# Altium schematic sheet Power.SchDoc
size 420 x 297 mm; SheetNumber: 4; SheetTotal: 14; PageSetup: Record=PageOptions|CenterHorizontal=True|CenterVertical=True|PrintScale=0.96|XCorrection=1.00|YCorrection=1.00|PrintKind=1|BorderSize=5000000|LeftOffset=0|BottomOffset=0|Orientation=2|PaperLength=4318|PaperWidth=2794|Scale=100|PaperSource=7|PrintQuality=600|MediaType=1|DitherType=10|PaperKind=11" x 17"|PrintScaleMode=1
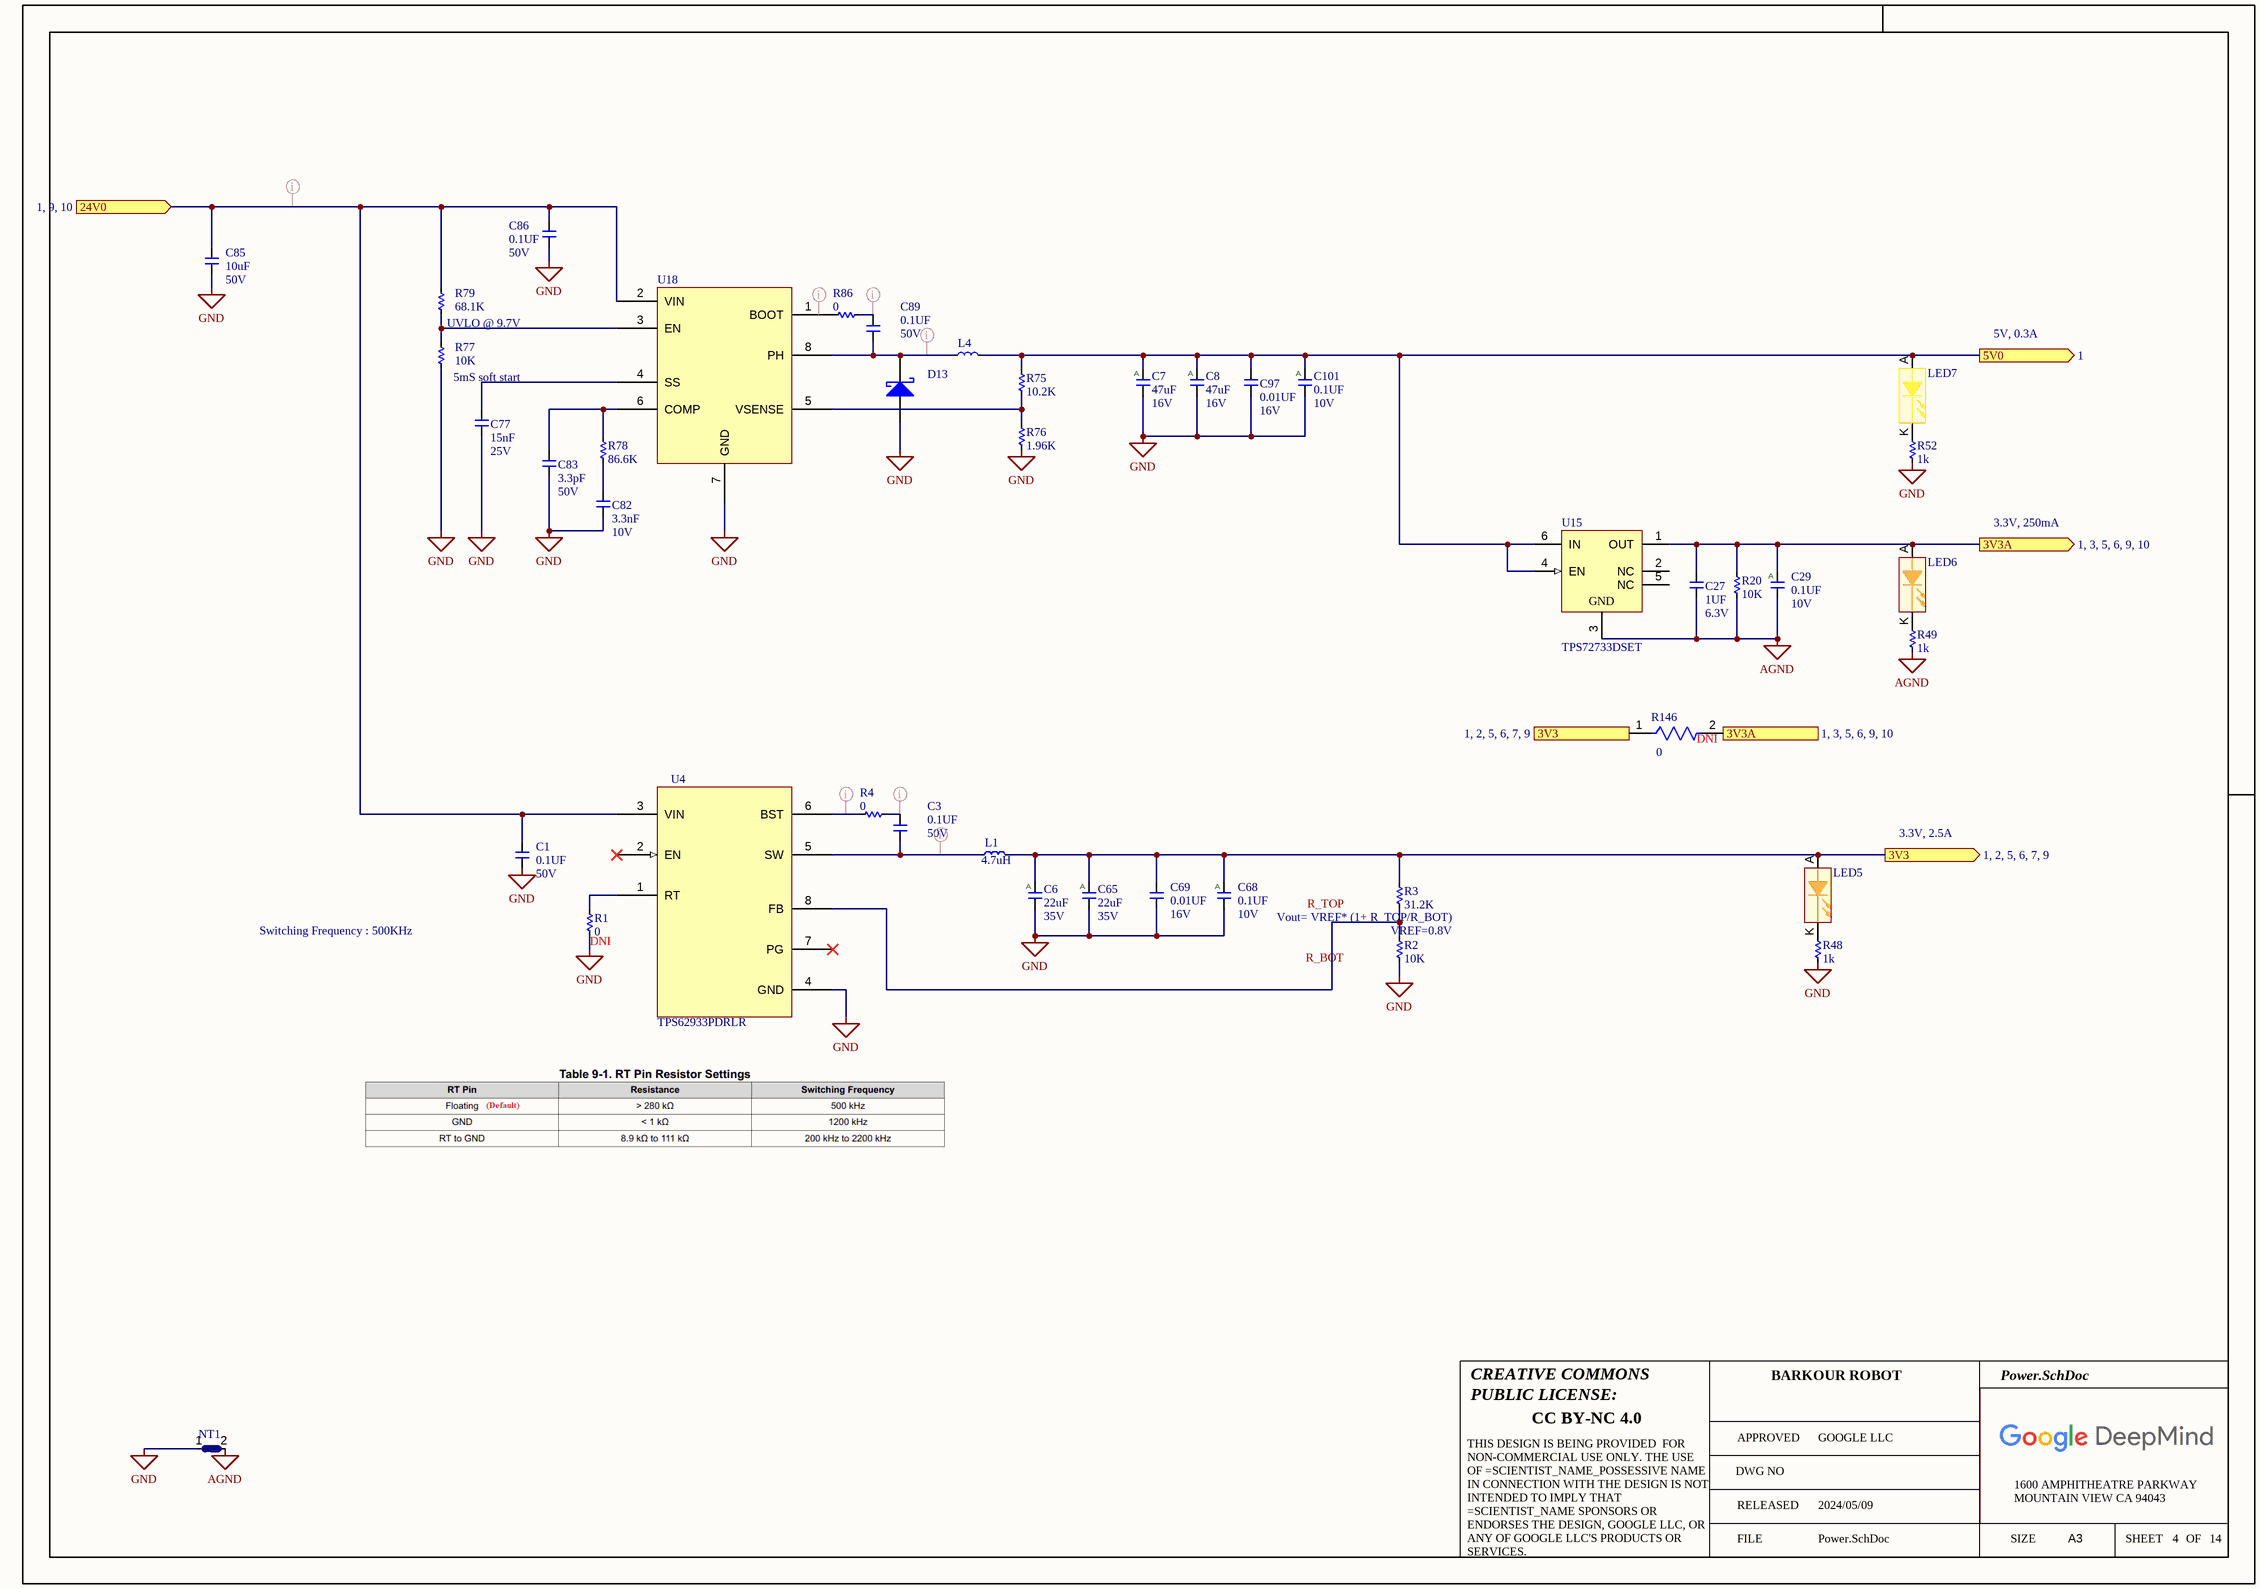
[diagram p0: Power.SchDoc]

## Parts
C1  value 0.1UF  Voltage: 50V  [C0402]  (hidden comment: __Template_Cap)
C3  value 0.1UF  Voltage: 50V  [C0402]  (hidden comment: __Template_Cap)
C6  Voltage: 35V  [C1206]  (hidden comment: 22uF)
C7  value 47uF  Voltage: 16V  [C2220]  (hidden comment: __Template_Cap_Auto)
C8  value 47uF  Voltage: 16V  [C2220]  (hidden comment: __Template_Cap_Auto)
C27  value 1UF  Voltage: 6.3V  [C0201]  (hidden comment: __Template_Cap)
C29  value 0.1UF  Voltage: 10V  [C0201]  (hidden comment: __Template_Cap_Auto)
C65  Voltage: 35V  [C1206]  (hidden comment: 22uF)
C68  value 0.1UF  Voltage: 10V  [C0201]  (hidden comment: __Template_Cap_Auto)
C69  value 0.01UF  Voltage: 16V  [C0201]  (hidden comment: __Template_Cap)
C77  value 15nF  Voltage: 25V  [C0402]  (hidden comment: __Template_Cap)
C82  value 3.3nF  Voltage: 10V  [C0201]  (hidden comment: __Template_Cap)
C83  value 3.3pF  Voltage: 50V  [C0201]  (hidden comment: __Template_Cap)
C85  value 10uF  Voltage: 50V  [C1210]  (hidden comment: __Template_Cap)
C86  value 0.1UF  Voltage: 50V  [C0402]  (hidden comment: __Template_Cap)
C89  value 0.1UF  Voltage: 50V  [C0402]  (hidden comment: __Template_Cap)
C97  value 0.01UF  Voltage: 16V  [C0201]  (hidden comment: __Template_Cap)
C101  value 0.1UF  Voltage: 10V  [C0201]  (hidden comment: __Template_Cap_Auto)
D13  __Template_DIODE_SCHOTTKY  [SOD-123_H1.35MM]  (value not drawn)
L1  4.7uH  [IND_78438357047]
L4  COILCRAFT_LPS3015-473  [COILCRAFT_LPS3015-473]  (value not drawn)
LED5  __Template_LED_ORANGE_AK  [LED_APG0603SYC-TT]  (value not drawn)
LED6  __Template_LED_ORANGE_AK  [LED_APG0603SYC-TT]  (value not drawn)
LED7  __Template_LED_YELLOW_AK  [LED_APG0603SYC-TT]  (value not drawn)
NT1  _Template_NETTIE  [NETTIE_0402]  (value not drawn)  (net tie, no BOM)
R1  0  [R0402]
R2  10K  [R0402]
R3  31.2K  [R0402]
R4  0  [R0402]
R20  value 10K  [R0201]  (hidden comment: __Template_Resistor)
R48  value 1k  [R0201]  (hidden comment: __Template_Resistor)
R49  value 1k  [R0201]  (hidden comment: __Template_Resistor)
R52  value 1k  [R0201]  (hidden comment: __Template_Resistor)
R75  10.2K  [R0201]
R76  1.96K  [R0201]
R77  value 10K  [R0201]  (hidden comment: __Template_Resistor)
R78  86.6K  [R0201]
R79  68.1K  [R0402]
R86  0  [R0402]
R146  0  [R0402]
U4  TPS62933PDRLR  [SOT-583]
U15  TPS72733DSET  [6WSON]
U18  TI_TPS54331GDR  [SOIC127P600X175-8N]  (value not drawn)

## Ports
3V3 (out, see 1, 2, 5, 6, 7, 9), 3V3A (out, see 1, 3, 5, 6, 9, 10), 5V0 (out, see 1), 24V0 (in, see 1, 9, 10)

## Nets
AGND: C27.2 C29.2 NT1.2 R20.1 R49.2 U15.3(GND)
GND: C1.2 C6.2 C7.2 C8.2 C65.2 C68.2 C69.2 C77.2 C82.2 C83.2 C85.2 C86.2 C97.2 C101.2 D13.A NT1.1 R1.1 R2.1 R48.2 R52.2 R76.1 R77.1 U4.4(GND) U18.7(GND)
3V3: C6.1 C65.1 C68.1 C69.1 L1.2 LED5.A R3.2 R146.1 ; port 3V3
3V3A: C27.1 C29.1 LED6.A R20.2 R146.2 U15.1(OUT) ; port 3V3A
5V0: C7.1 C8.1 C97.1 C101.1 L4.2 LED7.A R75.2 U15.4(EN) U15.6(IN) ; port 5V0
24V0: C1.1 C85.1 C86.1 R79.2 U4.3(VIN) U18.2(VIN) ; port 24V0
NetC3_1: C3.1 R4.2
NetC3_2: C3.2 L1.1 U4.5(SW)
NetC77_1: C77.1 U18.4(SS)
NetC82_1: C82.1 R78.1
NetC83_1: C83.1 R78.2 U18.6(COMP)
NetC89_1: C89.1 R86.2
NetC89_2: C89.2 D13.K L4.1 U18.8(PH)
NetLED5_K: LED5.K R48.1
NetLED6_K: LED6.K R49.1
NetLED7_K: LED7.K R52.1
NetR1_2: R1.2 U4.1(RT)
NetR2_2: R2.2 R3.1 U4.8(FB)
NetR4_1: R4.1 U4.6(BST)
NetR75_1: R75.1 R76.2 U18.5(VSENSE)
NetR77_2: R77.2 R79.1 U18.3(EN)
NetR86_1: R86.1 U18.1(BOOT)

Not connected (* = marked no-connect by the designer): U4 2(EN)* 7(PG)*; U15 2(NC) 5(NC)

## Layout directives
net class 24V: 24V0, (no net found under the mark), NetC3_1, NetC3_2, NetC89_1, NetC89_2, NetR4_1

## Notes on the sheet
- UVLO @ 9.7V
- 5mS soft start
- 5V, 0.3A
- 3.3V, 250mA
- 3.3V, 2.5A
- (near R1) Switching Frequency : 500KHz
- (near R3) R_TOP
- Vout= VREF* (1+ R_TOP/R_BOT)
- VREF=0.8V
- (near R2) R_BOT
- CREATIVE COMMONS
- PUBLIC LICENSE:
- BARKOUR ROBOT
- CC BY-NC 4.0
- APPROVED
- DWG NO
- GOOGLE LLC
- FILE
- RELEASED
- 2024/05/09
- SIZE
- 1600 AMPHITHEATRE PARKWAY
- MOUNTAIN VIEW CA 94043
- A3
- SHEET
- OF
- THIS DESIGN IS BEING PROVIDED  FOR NON-COMMERCIAL USE ONLY. THE USE OF =SCIENTIST_NAME_POSSESSIVE NAME IN CONNECTION WITH THE DESIGN IS NOT INTENDED TO IMPLY THAT =SCIENTIST_NAME SPONSORS OR ENDORSES THE DESIGN, GOOGLE LLC, OR ANY OF GOOGLE LLC'S PRODUCTS OR SERVICES.
- (in symbol 163) A
- (in symbol 934) A

## Library data of the parts
C1 C3 C86 C89 = 1762: CAP, CER, X5R, 0.1uF, 10%, 50V, 0402, 0.55mm; MFG: YAGEO; MFG P/N: CC0402KRX5R9BB104; Status: Released; Package: 0402; Supplier 1: Digi-Key; ComponentLink1URL: http://www.yageo.com/documents/recent/UPY-GPHC_X5R_4V-to-50V_25.pdf; Supplier Part Number 1: 311-3342-1-ND
C6 C65 = 163: CAP CER 22UF 35V X5R 1206; MFG: TDK Corporation; MFG P/N: C3216X5R1V226M160AC; Status: Released; Package: 1206; Value: 22uF; Supplier 1: Digi-Key; ComponentLink1URL: https://www.digikey.com/en/products/detail/tdk-corporation/C3216X5R1V226M160AC/2792261?s=N4IgTCBcDaIMIGYwEYBsANArAJWQNTDFQFk0AGAQThAF0BfIA; Supplier Part Number 1: 445-8045-1-ND
C7 C8 = 163: CAP, CER, X7R, 47uF, 16V, 20%, AUTO GRADE, 2220, 2.5mm T; MFG: TDK; MFG P/N: CGA9N3X7R1C476M230KB; COMMON: 150-00499-00; Status: Released; Package: 2220; Supplier 1: Digi-Key; ComponentLink1URL: https://www.digikey.com/en/products/detail/tdk-corporation/CGA9N3X7R1C476M230KB/2781361; Supplier Part Number 1: 445-7935-1-ND
C27 = 240: CAP, CER, X5R, 1uF, 6.3V, 20%, 0201, 0.33mm T; MFG: SAMSUNG; MFG P/N: CL03A105MQ3CSNC; COMMON: 150-00980-00; Status: Released; Package: 0201; Supplier 1: Digi-Key; ComponentLink1URL: https://www.digikey.com/en/products/detail/samsung-electro-mechanics/CL03A105MQ3CSNC/3886983; Supplier Part Number 1: 1276-1325-1-ND
C29 C68 C101 = 934: CAP, CER, X6S, 0.1uF, 10V, 10%, 0201, AUTOGRADE; MFG: MURATA; MFG P/N: GRT033C81A104KE01D; COMMON: 150-01178-00; Status: Released; Package: 0201; Supplier 1: Digi-key; ComponentLink1URL: https://search.murata.co.jp/Ceramy/image/img/A01X/G101/ENG/GRT033C81A104KE01-01.pdf; Supplier Part Number 1: 490-12232-1-ND
C69 C97 = 361: CAP, CER, X5R, 0.01uF, 16V, 10%, 0201, 0.33mm T; MFG: MURATA; MFG P/N: GRM033R61C103KA12D; COMMON: 150-00126-00; Status: Released; Package: 0201; Supplier 1: Digi-Key; ComponentLink1URL: https://www.digikey.com/en/products/detail/murata-electronics/GRM033R61C103KA12D/4213197; Supplier Part Number 1: 490-7223-1-ND
C77 = 838: CAP, CER, X7R, 0.015uF, 25V, 10%, 0402, 0.56mm T; MFG: MURATA; MFG P/N: GRM155R71E153KA61D; COMMON: 150-00741-00; Status: NRND; Package: 0402; Supplier 1: Digi-Key; ComponentLink1URL: https://www.digikey.com/en/products/detail/murata-electronics/GRM155R71E153KA61D/702516; Supplier Part Number 1: 490-3251-1-ND
C82 = 343: CAP, CER, X5R, 3300pF, 10V, 10%, 0201, 0.33mm T; MFG: AVX; MFG P/N: 0201ZD332KAT2A; COMMON: 150-00555-00; Status: Released; Package: 0201; Supplier 1: Digi-Key; ComponentLink1URL: https://www.digikey.com/en/products/detail/kyocera-avx/0201ZD332KAT2A/563155; Supplier Part Number 1: 478-1045-1-ND
C83 = 589: CAP, CER, NP0, 3.3pF, 50V, +/-0.25pF, 0201, 0.33mm T; MFG: MURATA; MFG P/N: GRM0335C1H3R3CA01D; COMMON: 150-00958-00; Status: Released; Package: 0201; Supplier 1: Digi-Key; ComponentLink1URL: https://www.digikey.com/en/products/detail/murata-electronics/GRM0335C1H3R3CA01D/2542225; Supplier Part Number 1: 490-6128-1-ND
C85 = 1813: CAP, CER, X5R, 10uF, 50V, 20%, 1210; MFG: TAIYO YUDEN; MFG P/N: UMK325BJ106MM-T; Status: Released; Package: 1210; Supplier 1: Digi-Key; ComponentLink1URL: https://media.digikey.com/pdf/Data%20Sheets/Taiyo%20Yuden%20PDFs%20URL%20links/UMK325BJ106MM-T_Spec.pdf; Supplier Part Number 1: 587-2225-1-ND
D13 = 290: DIODE, SCHOTTKY, 30V VRRM, 1A IO, 12A SURGE, SOD-123; MFG: Diodes Incorporated; MFG P/N: B130LAW-7-F; Value: B130LAW-7-F; Status: Released; Package: SOD-123; Supplier 1: Digi-Key; ComponentLink1URL: https://www.diodes.com/assets/Datasheets/ds30308.pdf; Supplier Part Number 1: B130LAW-FDICT-ND
L1 = BOURNS_SRR1050A-180Y: FIXED IND 4.7UH 3.9A 44MOHM SMD; MFG: Würth Elektronik; MFG P/N: 78438357047; Supplier 1: Digi-Key; Supplier Part Number 1: 732-11742-1-ND; ComponentLink1URL: https://www.bourns.com/docs/Product-Datasheets/SRR1050A.pdf?src-supplier=Digi-Key; Value: 4.7uH
L4 = COILCRAFT_LPS3015-473: COILCRAFT   LPS3015-473MRB   INDUCTOR, SHLD, 47UH, 20%, 0.3A, SMD; MFG P/N: XFL3012-473MEC; Supplier 1: Mouser; Supplier Part Number 1: 994-XFL3012-473MEC; ComponentLink1URL: https://www.mouser.com/ProductDetail/Coilcraft/XFL3012-473MEC?qs=zCSbvcPd3pb%2FTL0aawZbwA%3D%3D; MFG: Coilcraft; Value: 47uH
LED5 LED6 = 308: LED, ORANGE, 611NM, 10mA, CLEAR, 0201; MFG: Kingbright; MFG P/N: APG0603SEC-TT; Value: APG0603SEC-TT; Status: Released; Package: 0201; Supplier 1: Digi-Key; ComponentLink1URL: http://www.kingbrightusa.com/images/catalog/SPEC/APG0603SEC-TT.pdf; Supplier Part Number 1: 754-2027-1-ND
LED7 = 307: LED, YELLOW, 591NM, 10mA, CLEAR, 0201; MFG: Kingbright; MFG P/N: APG0603SYC-TT; Value: APG0603SYC-TT; Status: Released; Package: 0201; Supplier 1: Digi-Key; ComponentLink1URL: http://www.kingbrightusa.com/images/catalog/SPEC/APG0603SYC-TT.pdf; Supplier Part Number 1: 754-2025-1-ND
NT1 = 158: Net Ties, 0402; MFG: _PCB Feature; Status: Released
R1 R4 R86 = 8004: RES, 0, JUMPER, 1/16W, 0402; MFG: YAGEO; MFG P/N: RC0402FR-070RL; COMMON: 470-02332-00; Status: Released; Package: 0402; Value: 0; Supplier 1: Digi-Key; ComponentLink1URL: https://www.digikey.com/en/products/detail/yageo/RC0402FR-070RL/2827570; Supplier Part Number 1: 311-0.0LRCT-ND
  R1: DNI: DNI
R2 = 7216: RES, 10K, 1%, 1/10W, 0402, AUTOGRADE; MFG: PANASONIC; MFG P/N: ERJ2RKF1002X; COMMON: 470-00319-00; Status: Released; Package: 0402; Value: 10K; Supplier 1: Digi-Key; ComponentLink1URL: https://www.digikey.com/en/products/detail/panasonic-electronic-components/ERJ-2RKF1002X/192073; Supplier Part Number 1: P10.0KLCT-ND
R3 = 4161: RES 31.2K OHM 1% 1/16W 0402; MFG: KOA Speer Electronics, Inc.; MFG P/N: RN73H1ETTP3122F25; Status: Released; Package: 0402; Value: 31.2K; Supplier 1: Digi-Key; ComponentLink1URL: https://www.digikey.com/en/products/detail/yageo/RC0201FR-0710K2L/1948867; Supplier Part Number 1: 2019-RN73H1ETTP3122F25CT-ND
R20 R77 = 6783: RES, 10K, 1%, 1/20W, 0201, AUTOGRADE; MFG: PANASONIC; MFG P/N: ERJ1GNF1002C; COMMON: 470-00033-00; Status: Released; Package: 0201; Supplier 1: Digi-Key; ComponentLink1URL: https://industrial.panasonic.com/cdbs/www-data/pdf/RDA0000/AOA0000C304.pdf; Supplier Part Number 1: P122414CT-ND
R48 R49 R52 = 10010: RES, 1K, 1%, 1/20W, 0201, AUTOGRADE; MFG: Bourns Inc.; MFG P/N: CR0201AFW-1001GLF; Status: Released; Package: 0201; Supplier 1: Digi-Key; ComponentLink1URL: https://www.bourns.com/docs/product-datasheets/crxxxxa.pdf; Supplier Part Number 1: 118-CR0201AFW-1001GLFCT-ND
R75 = 4161: Resistor, 10.2K Ohms, 0201, 0.05W, ±1%; MFG: YAGEO; MFG P/N: RC0201FR-0710K2L; COMMON: 470-07513-00; Status: Released; Package: 0201; Value: 10.2K; Supplier 1: Digi-Key; ComponentLink1URL: https://www.digikey.com/en/products/detail/yageo/RC0201FR-0710K2L/1948867; Supplier Part Number 1: 311-10.2KMCT-ND
R76 = 6790: RES, 1.96K, 1%, 1/20W, 0201; MFG: PANASONIC; MFG P/N: ERJ1GEF1961C; COMMON: 470-00892-00; Status: NRND; Package: 0201; Value: 1.96K; Supplier 1: Digi-Key; ComponentLink1URL: https://www.digikey.com/en/products/detail/panasonic-electronic-components/ERJ-1GEF1961C/1467048; Supplier Part Number 1: P1.96KABCT-ND
R78 = 4926: Resistor, 86.6K Ohms, 0201, 0.05W, ±1%; MFG: PANASONIC; MFG P/N: ERJ-1GNF8662C; Status: Released; Package: 0201; Value: 86.6K; Supplier 1: Digi-Key; ComponentLink1URL: https://www.digikey.com/en/products/detail/panasonic-electronic-components/ERJ-1GNF8662C/8343311; Supplier Part Number 1: P123186CT-ND
R79 = 10007: RES, 68.1K, 1%, 1/16W, 0402; MFG: Stackpole Electronics Inc; MFG P/N: RMCF0402FT68K1; Status: Released; Package: 0402; Value: 68.1K; Supplier 1: Digi-Key; ComponentLink1URL: https://www.digikey.com/en/products/detail/stackpole-electronics-inc/RMCF0402FT68K1/1761637; Supplier Part Number 1: RMCF0402FT68K1CT-ND
R146 = CMP-2002-08122-2: RES, 0, JUMPER, 1/16W, 0402; MFG: YAGEO; MFG P/N: RC0402FR-070RL; COMMON: 470-02332-00; ComponentLink1URL: https://www.digikey.com/en/products/detail/yageo/RC0402FR-070RL/2827570; Supplier 1: Digi-Key; Supplier Part Number 1: 311-0.0LRCT-ND; Value: 0; Package: 0402; Status: Released; DNI: DNI
U4 = TI_TPS62933PDRLR: IC REG BUCK ADJUSTABLE 3A SOT583; MFG: Texas Instruments; Supplier 1: Digi-Key; Supplier Part Number 1: 296-TPS62933PDRLRCT-ND; ComponentLink1URL: https://datasheet.ciiva.com/2034/tps54331-2034843.pdf?src-supplier=Digi-Key; MFG P/N: TPS62933PDRLR; Value: TPS62933PDRLR
U15 = CMP-0394-01493-2: IC REG LINEAR 3.3V 250MA 6WSON; MFG: Texas Instruments; ComponentLink1URL: http://www.ti.com/; MFG P/N: TPS72733DSET; Supplier 1: Digi-Key; Supplier Part Number 1: 296-27803-1-ND; Value: TPS72733DSET
U18 = TI_TPS54331GDR: Conv DC-DC Single Step Down 3.5V to 28V 8-Pin SOIC T/R; MFG: Texas Instruments; Supplier 1: Digi-Key; Supplier Part Number 1: 296-50099-1-ND; ComponentLink1URL: https://datasheet.ciiva.com/2034/tps54331-2034843.pdf?src-supplier=Digi-Key; MFG P/N: TPS54331GDR; Value: TPS54331GDR